# EAGLE schematic apex2_1 (EAGLE 5.09)
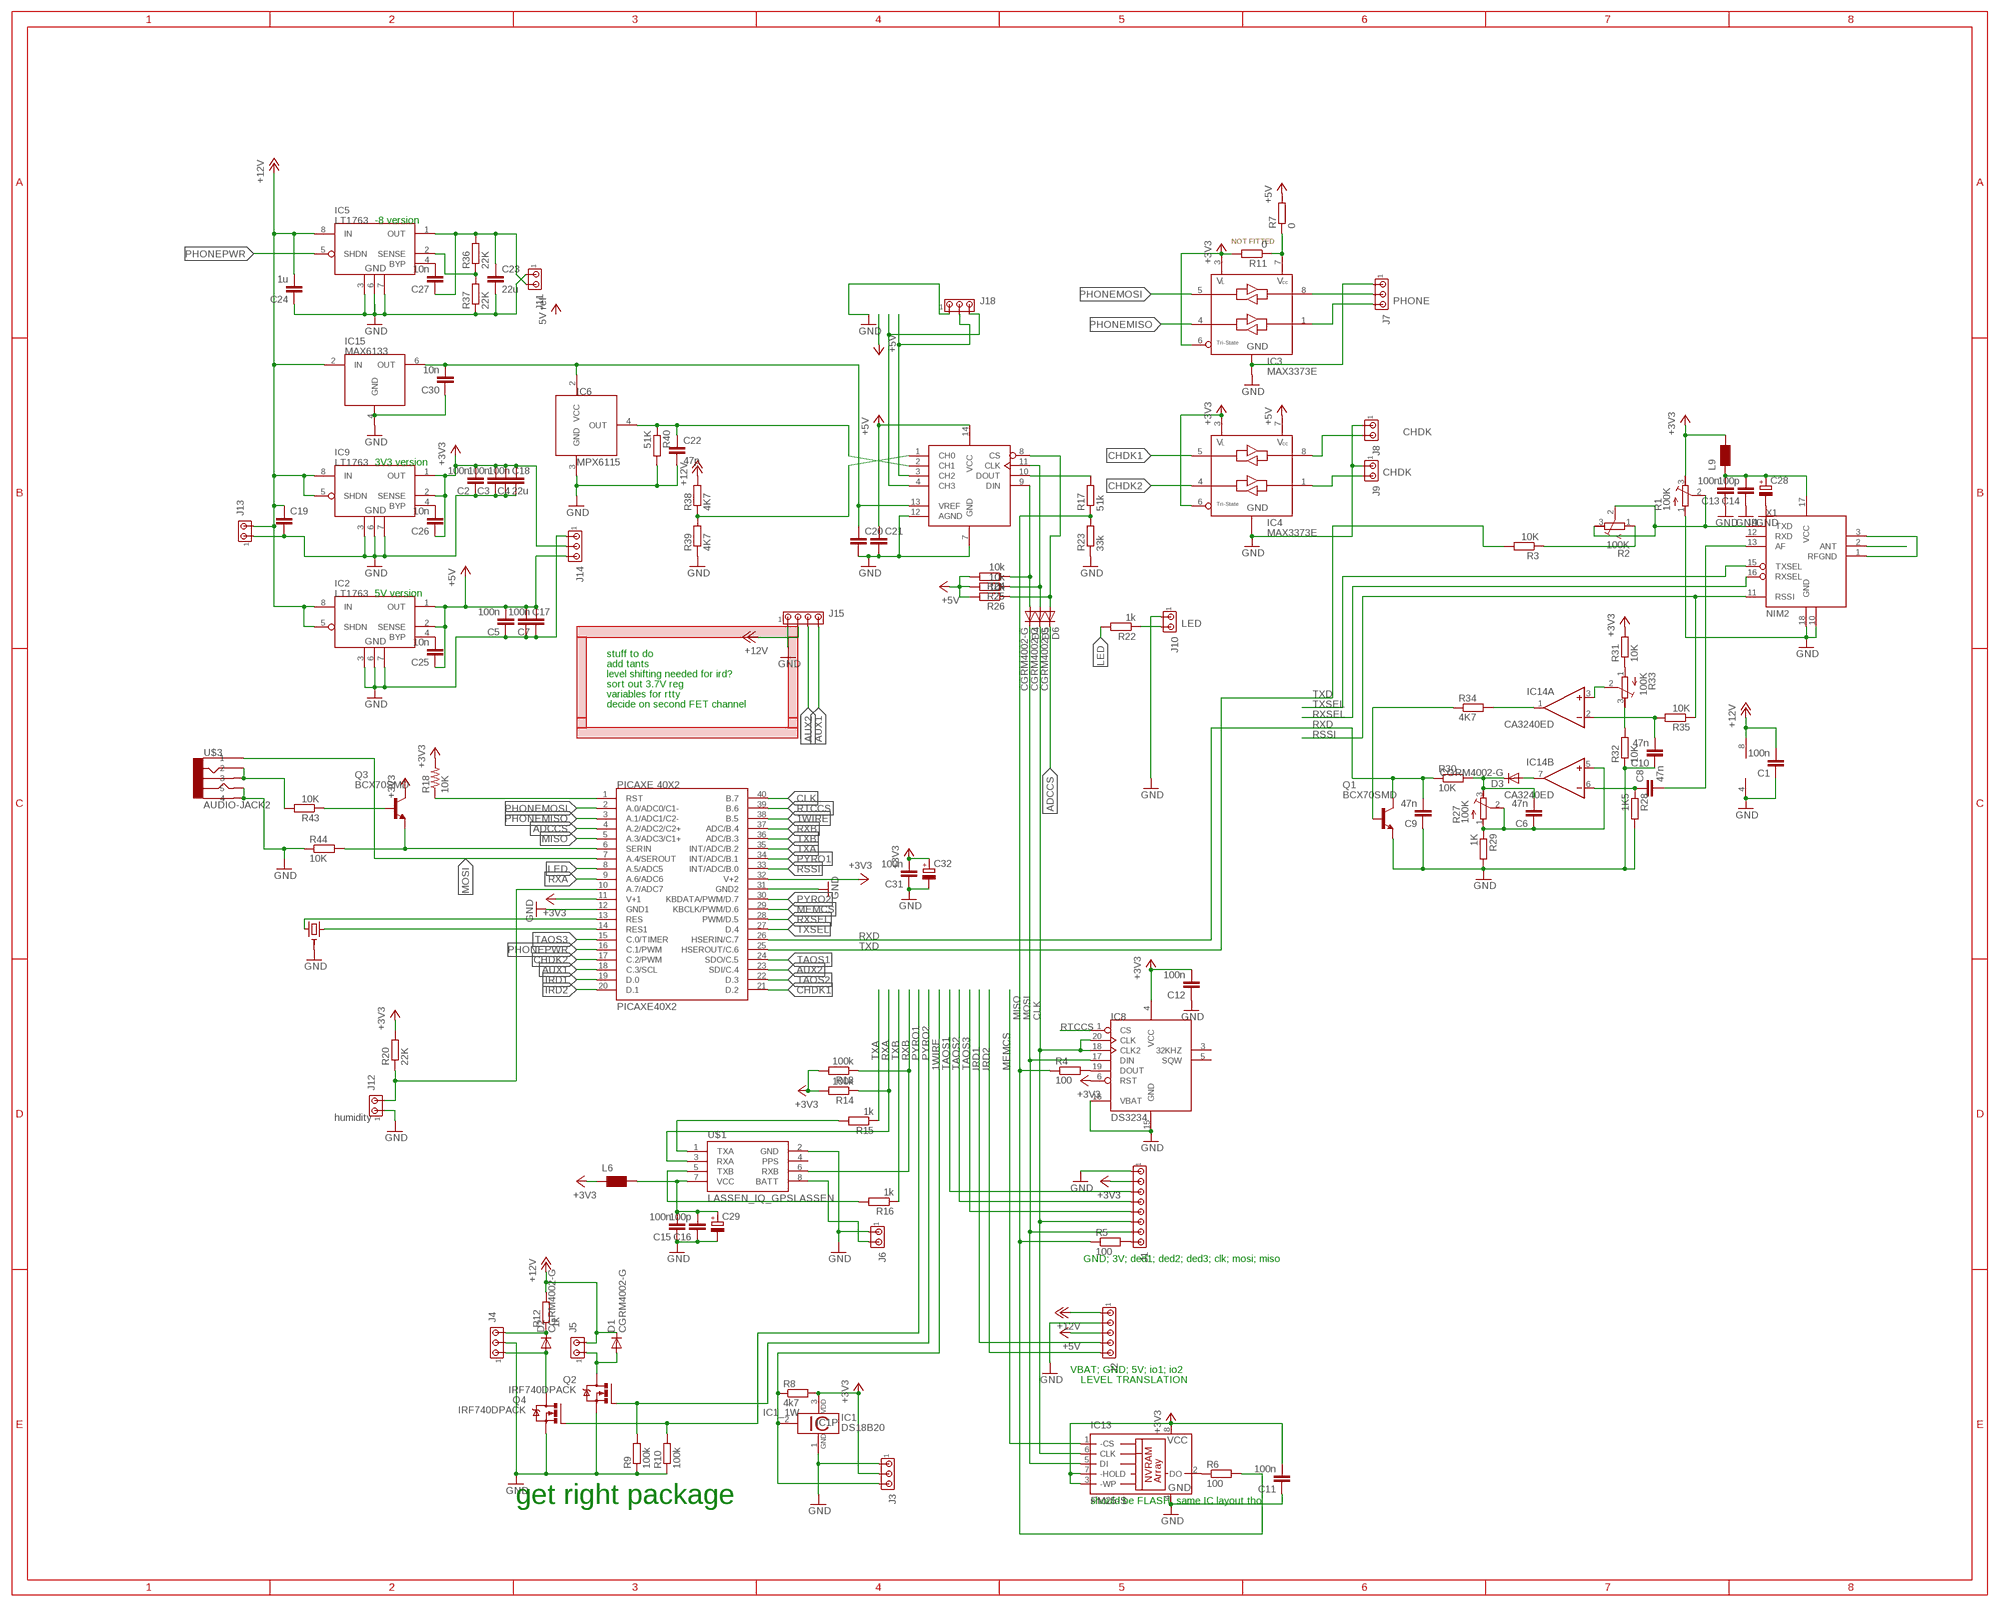
[diagram p0: schematic, sheet 1]

## Parts
C1  100n  C-EUC0805  [C0805]
C2  100n  C-EUC0805  [C0805]
C3  100n  C-EUC0805  [C0805]
C4  100n  C-EUC0805  [C0805]
C5  100n  C-EUC0805  [C0805]
C6  47n  C-EUC0805  [C0805]
C7  100n  C-EUC0805  [C0805]
C8  47n  C-EUC0805  [C0805]
C9  47n  C-EUC0805  [C0805]
C10  47n  C-EUC0805  [C0805]
C11  100n  C-EUC0805  [C0805]
C12  100n  C-EUC0805  [C0805]
C13  100n  C-EUC0805  [C0805]
C14  100p  C-EUC0805  [C0805]
C15  100n  C-EUC0805  [C0805]
C16  100p  C-EUC0805  [C0805]
C17  C-EUC1210  [C1210]
C18  22u  C-EUC1210  [C1210]
C19  C-EUC1210  [C1210]
C20  C-EUC0805  [C0805]
C21  C-EUC0805  [C0805]
C22  47p  C-EUC0805  [C0805]
C23  22u  C-EUC1210  [C1210]
C24  1u  C-EUC0805  [C0805]
C25  10n  C-EUC0805  [C0805]
C26  10n  C-EUC0805  [C0805]
C27  10n  C-EUC0805  [C0805]
C28  CPOL-EUSMCB  [SMC_B]
C29  CPOL-EUSMCB  [SMC_B]
C30  10n  C-EUC0805  [C0805]
C31  100n  C-EUC0805  [C0805]
C32  CPOL-EUSMCB  [SMC_B]
D1  CGRM4002-G  [SOD-123_MINI-SMA]
D2  CGRM4002-G  [SOD-123_MINI-SMA]
D3  CGRM4002-G  [SOD-123_MINI-SMA]
D4  CGRM4002-G  [SOD-123_MINI-SMA]
D5  CGRM4002-G  [SOD-123_MINI-SMA]
D6  CGRM4002-G  [SOD-123_MINI-SMA]
IC1  DS18B20  [TO92-]
IC2  LT1763  [SO08]
IC3  MAX3373E  [SOT23-8L]
IC4  MAX3373E  [SOT23-8L]
IC5  LT1763  [SO08]
IC6  MPX6115  [SO8-7_5]
IC7  MCP3204  [TSSOP14]
IC8  DS3234  [SO20W]
IC9  LT1763  [SO08]
IC13  FM25-S  [SO8]
IC14  CA3240ED  [SO08]
IC15  MAX6133  [SO08]
J1  MTA08-100  [10X08MTA]
J2  MTA05-100  [10X05MTA]
J3  MTA03-100  [10X03MTA]
J4  MTA03-100  [10X03MTA]
J5  MTA02-100  [10X02MTA]
J6  MTA02-100  [10X02MTA]
J7  MTA03-100  [10X03MTA]
J8  MTA02-100  [10X02MTA]
J9  MTA02-100  [10X02MTA]
J10  MTA02-100  [10X02MTA]
J11  MTA02-100  [10X02MTA]
J12  MTA02-100  [10X02MTA]
J13  MTA02-100  [10X02MTA]
J14  MTA03-100  [10X03MTA]
J15  MTA04-100  [10X04MTA]
J18  MTA03-100  [10X03MTA]
L6  WE-CBF_1210  [1210]
L9  WE-CBF_1812  [1812]
PIC1  PICAXE40X2  [DIL40]
Q1  BCX70SMD  [SOT23]
Q2  IRF740DPACK  [DPACK_1]
Q3  BCX70SMD  [SOT23]
Q4  IRF740DPACK  [DPACK_1]
R1  100K  R-TRIMM3214W  [RTRIM3214W]
R2  100K  R-TRIMM3214W  [RTRIM3214W]
R3  10K  R-EU_R0805  [R0805]
R4  100  R-EU_R0805  [R0805]
R5  100  R-EU_R0805  [R0805]
R6  100  R-EU_R0805  [R0805]
R7  0  R-EU_R0805  [R0805]
R8  4k7  R-EU_R0805  [R0805]
R9  100k  R-EU_R0805  [R0805]
R10  100k  R-EU_R0805  [R0805]
R11  0  R-EU_R0805  [R0805]
R12  1k  R-EU_R0805  [R0805]
R13  100k  R-EU_R0805  [R0805]
R14  100k  R-EU_R0805  [R0805]
R15  1k  R-EU_R0805  [R0805]
R16  1k  R-EU_R0805  [R0805]
R17  51k  R-EU_R0805  [R0805]
R18  10K  RESISTOR  [0805]
R20  22K  R-EU_R0805  [R0805]
R22  1k  R-EU_R0805  [R0805]
R23  33k  R-EU_R0805  [R0805]
R24  10k  R-EU_R0805  [R0805]
R25  10k  R-EU_R0805  [R0805]
R26  10k  R-EU_R0805  [R0805]
R27  100K  R-TRIMM3214W  [RTRIM3214W]
R28  1K5  R-EU_R0805  [R0805]
R29  1K  R-EU_R0805  [R0805]
R30  10K  R-EU_R0805  [R0805]
R31  10K  R-EU_R0805  [R0805]
R32  10K  R-EU_R0805  [R0805]
R33  100K  R-TRIMM3214W  [RTRIM3214W]
R34  4K7  R-EU_R0805  [R0805]
R35  10K  R-EU_R0805  [R0805]
R36  22K  R-EU_R0805  [R0805]
R37  22K  R-EU_R0805  [R0805]
R38  4K7  R-EU_R0805  [R0805]
R39  4K7  R-EU_R0805  [R0805]
R40  51K  R-EU_R0805  [R0805]
R43  10K  R-EU_R0805  [R0805]
R44  10K  R-EU_R0805  [R0805]
U$1  LASSEN_IQ_GPSLASSEN  [LASSEN_IQ_GPS]
U$2  RESONATOR_4M  [CSTLS_G8]
U$3  AUDIO-JACK2  [AUDIO-JACK]
X1  NIM2  [NIM2PK]

## Nets
1WIRE: IC1.2 J3.3 PIC1.38(B.5) R8.1
+3V3: C2.2 C3.2 C4.2 C11.2 C12.2 C18.1 C26.1 C31.2 C32.+ IC1.3 IC3.3(VL) IC3.6(TRIIN) IC4.3(VL) IC4.6(TRIIN) IC8.4(VCC) IC8.6(RST) IC9.1(OUT) IC9.2(SENSE) IC13.3(-WP) IC13.7(-HOLD) IC13.8(VCC) J1.2 J3.2 J14.2 L6.1 L9.2 PIC1.11(V+1) PIC1.32(V+2) Q3.3(C) R1.3(A) R8.2 R11.2 R13.2 R14.2 R18.2 R20.2 R31.2
+5V: C5.2 C7.2 C17.1 C21.1 C25.1 IC2.1(OUT) IC2.2(SENSE) IC4.7(VCC) IC7.14(VCC) J2.3 J14.3 R7.2 R24.2 R25.2 R26.2
+12V: C1.2 C19.1 C24.2 D1.C IC2.5(SHDN) IC2.8(IN) IC5.8(IN) IC9.5(SHDN) IC9.8(IN) IC14.8(P:V+) IC15.2(IN) J2.1 J5.2 J13.2 J15.2 R12.2 R38.2
ADCCS: D6.C PIC1.4(A.2/ADC2/C2+)
AUX1: J15.4 PIC1.18(C.3/SCL)
AUX2: J15.3 PIC1.23(SDI/C.4)
CHDK1: IC4.5(IOLO1) PIC1.21(D.2)
CHDK2: IC4.4(IOLO2) PIC1.17(C.2/PWM)
CLK: D5.C IC8.18(CLK2) IC8.20(CLK) IC13.6(CLK) J1.6 PIC1.40(B.7)
DDV: D6.A IC7.8(CS) R26.1
GND: C1.1 C2.1 C3.1 C4.1 C5.1 C7.1 C9.1 C10.1 C11.1 C12.1 C13.1 C14.1 C15.1 C16.1 C17.2 C18.2 C19.2 C20.2 C21.2 C22.2 C23.2 C24.1 C28.- C29.- C31.1 C32.- IC1.1 IC2.3(GND1) IC2.6(GND2) IC2.7(GND3) IC3.2(GND) IC4.2(GND) IC5.3(GND1) IC5.6(GND2) IC5.7(GND3) IC6.3(GND) IC7.7(GND) IC7.12(AGND) IC8.15(GND) IC8.16(VBAT) IC9.3(GND1) IC9.6(GND2) IC9.7(GND3) IC13.4(GND) IC14.4(P:V-) IC15.4(GND) J1.1 J2.2 J3.1 J4.2 J6.1 J7.1 J8.1 J9.1 J10.1 J11.1 J12.1 J13.1 J14.1 J15.1 J18.1 PIC1.12(GND1) PIC1.31(GND2) Q1.2(E) Q2.E(S) Q4.E(S) R1.1(E) R9.1 R10.1 R23.1 R28.2 R29.2 R32.1 R37.1 R39.1 R40.2 R44.1 U$1.2(GND) U$2.2(GND) U$3.4 U$3.5 X1.10(GND10) X1.18(GND)
IRD1: J2.4 PIC1.19(D.0)
IRD2: J2.5 PIC1.20(D.1)
LED: PIC1.8(A.5/ADC5) R22.2
MEMCS: IC13.1(-CS) PIC1.29(KBCLK/PWM/D.6)
MISO: PIC1.5(A.3/ADC3/C1+) R4.1 R5.1 R6.2 R17.1 R23.2
MOSI: D4.C IC8.17(DIN) IC13.5(DI) J1.7 PIC1.7(A.4/SEROUT) U$3.1
N$1: R16.2 U$1.5(TXB)
N$2: IC8.19(DOUT) R4.2
N$3: R15.2 U$1.1(TXA)
N$4: J1.8 R5.2
N$5: IC13.2(DO) R6.1
N$6: IC7.10(DOUT) R17.2
N$7: IC3.7(VCC) R7.1 R11.1
N$8: PIC1.1(RST) R18.1
N$9: PIC1.14(RES1) U$2.3
N$10: PIC1.13(RES) U$2.1
N$11: R43.2 U$3.2 U$3.3
N$12: IC4.1(IOHI2) J9.2
N$13: X1.2(ANT)
N$14: C25.2 IC2.4(BYP)
N$15: C26.2 IC9.4(BYP)
N$16: C20.1 C30.2 IC6.2(VCC) IC7.13(VREF) IC15.6(OUT)
N$17: IC4.8(IOHI1) J8.2
N$18: R1.2(S) R2.2(S) R2.3(A) X1.14(TXD)
N$19: J10.2 R22.1
N$20: IC3.8(IOHI1) J7.2
N$21: C30.1
N$22: D5.A IC7.11(CLK) R25.1
N$23: IC3.1(IOHI2) J7.3
N$24: D1.A J5.1 Q2.C(D)
N$25: C27.2 IC5.4(BYP)
N$26: D4.A IC7.9(DIN) R24.1
N$27: IC5.2(SENSE) R36.1 R37.2
N$28: D2.A J4.1 Q4.C(D)
N$29: D2.C J4.3 R12.1
N$30: J6.2 U$1.8(BATT)
N$31: IC7.3(CH2) J18.2
N$32: IC7.4(CH3) J18.3
N$33: C23.1 C27.1 IC5.1(OUT) J11.2 R36.2
N$34: C22.1 IC6.4(OUT) IC7.2(CH1) R40.1
N$35: C13.2 C14.2 C28.+ L9.1 X1.17(VCC)
N$37: C8.2 X1.13(AF)
N$38: C8.1 IC14.6(B:-IN) R28.1
N$39: C6.1 IC14.5(B:+IN) R27.1(E) R27.2(S) R29.1
N$40: D3.A IC14.7(B:OUT)
N$41: C6.2 D3.C R27.3(A) R30.2
N$42: R31.1 R33.1(E)
N$43: C15.2 C16.2 C29.+ L6.2 U$1.7(VCC)
N$44: R32.2 R33.3(A)
N$45: IC14.3(A:+IN) R33.2(S)
N$46: R2.1(E) R3.1
N$47: Q1.1(B) R34.1
N$48: IC14.1(A:OUT) R34.2
N$49: C10.2 IC14.2(A:-IN) R35.2
N$50: J12.2 PIC1.10(A.7/ADC7) R20.1
N$69: IC7.1(CH0) R38.1 R39.2
N$78: Q3.1(B) R43.1
N$80: PIC1.6(SERIN) Q3.2(E) R44.2
PHONEMISO: IC3.4(IOLO2) PIC1.3(A.1/ADC1/C2-)
PHONEMOSI: IC3.5(IOLO1) PIC1.2(A.0/ADC0/C1-)
PHONEPWR: IC5.5(SHDN) PIC1.16(C.1/PWM)
PYRO1: PIC1.34(INT/ADC/B.1) Q4.B(G) R10.2
PYRO2: PIC1.30(KBDATA/PWM/D.7) Q2.B(G) R9.2
RFGND: X1.1(RFGND) X1.3(RFGND3)
RSSI: PIC1.33(INT/ADC/B.0) R35.1 X1.11(RSSI)
RTCCS: IC8.1(CS) PIC1.39(B.6)
RXA: PIC1.9(A.6/ADC6) R14.1 U$1.3(RXA)
RXB: PIC1.37(ADC/B.4) R13.1 U$1.6(RXB)
RXD: C9.2 PIC1.26(HSERIN/C.7) Q1.3(C) R30.1
RXSEL: PIC1.28(PWM/D.5) X1.16(RXSEL)
TAOS1: J1.3 PIC1.24(SDO/C.5)
TAOS2: J1.4 PIC1.22(D.3)
TAOS3: J1.5 PIC1.15(C.0/TIMER)
TXA: PIC1.35(INT/ADC/B.2) R15.1
TXB: PIC1.36(ADC/B.3) R16.1
TXD: PIC1.25(HSEROUT/C.6) R3.2
TXSEL: PIC1.27(D.4) X1.15(TXSEL)
Unconnected: IC8.3(32KHZ) IC8.5(SQW) U$1.4(PPS) X1.12(RXD)

## Notes on the sheet
- -8 version
- NOT FITTED
- PHONE
- CHDK
- 3V3 version
- CHDK
- 5V version
- LED
- stuff to do
- add tants
- level shifting needed for ird?
- sort out 3.7V reg
- variables for rtty
- decide on second FET channel
- humidity
- GND; 3V; ded1; ded2; ded3; clk; mosi; miso
- VBAT; GND; 5V; io1; io2
- LEVEL TRANSLATION
- get right package | should be FLASH, same IC layout tho

## Library data of the parts
C1-C27 C30 C31 = rcl:C-EU: CAPACITOR, European symbol
C28 C29 C32 = rcl:CPOL-EU: POLARIZED CAPACITOR, European symbol
D1-D6 = diode:CGRM400*-G: Molded plasitc,JEDEC SOD-123/Mini SMA Source: Comchip CGRM4001-G.pdf
IC1 = 1wire:DS18B20: Programmable Resolution Digital Thermometer This chip provides a onewire thermosensor with approx. 0.5°C accuracy. A programmable over/undertemperure alarm is available. The precision can be set from 9..12 bits. Notes: Vdd must be applied for accurate measurements at low temperatures, as the parasite power circuit otherwise heats the sensor. If parasite power is used, Vdd has to be connected to GND. The DS1822 is a low-cost thermometer chip, the DS18S20 is similar to the DS18B20, but with 9 Bit precision only. Author: Jan Kandziora <jjj@gmx.de>
IC2 IC5 IC9 = Mine:LT1763
IC3 IC4 = Mine:MAX3373E
IC6 = Mine:MPX6115
IC7 = Mine:MCP3204
IC8 = Mine:DS3234
IC13 = ramtron-2:FM25*: SPI Serial NVRAM
IC14 = linear:CA3240E: OP AMP
IC15 = Mine:MAX6133
J1 = con-amp:MTA08-100: AMP connector
J2 = con-amp:MTA05-100: AMP connector
J3 J4 J7 J14 J18 = con-amp:MTA03-100: AMP connector
J5 J6 J8-J13 = con-amp:MTA02-100: AMP connector
J15 = con-amp:MTA04-100: AMP connector
L6 L9 = wuerth-elektronik:WE-CBF: SMD EMI Suppression Ferrite Beads - excellent anti-EMI properties - low DCR - impedances till 3000 ohms - rated current up to 6 A
PIC1 = Mine:PICAXE40X2
Q1 Q3 = transistor-npn:BCX70*: NPN Transistor
Q2 Q4 = Mine:IRF740: N-CHANNEL MOS FET
R1 R2 R27 R33 = resistor:R-TRIMM: Trimm resistor
R3-R11 R13-R17 R20 R22-R26 R28-R32 R34-R40 R43 R44 = rcl:R-EU_: RESISTOR, European symbol
R12 = resistor:R-EU_: RESISTOR, European symbol
R18 = SparkFun:RESISTOR: Resistor Basic schematic elements and footprints for 0603, 1206, and PTH 1/10th watt (small) resistors.
U$1 = SparkFun:LASSEN_IQ_GPS: Lassen iq 12-Channel GPS receiver. Schematic and footprint production proven. Spark Fun Electronics SKU : GPS-00163. Surface mount mating connector : GPS-00170
U$2 = Mine:RESONATOR_4M
U$3 = SparkFun:AUDIO-JACK2
X1 = Mine:NIM2